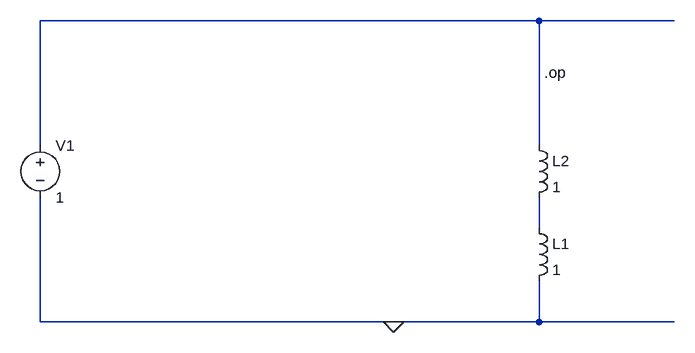
[diagram p0: schematic OP_V-DC_L+L.asc]
OP_V-DC_L+L.asc, the LTspice schematic file:
Version 4
SHEET 1 880 680
WIRE 640 64 -128 64
WIRE 848 64 640 64
WIRE -128 256 -128 64
WIRE 640 256 640 64
WIRE 640 384 640 336
WIRE -128 528 -128 336
WIRE 416 528 -128 528
WIRE 640 528 640 464
WIRE 640 528 416 528
WIRE 848 528 640 528
FLAG 416 528 0
SYMBOL voltage -128 240 R0
SYMATTR InstName V1
SYMATTR Value 1
SYMBOL ind 624 368 R0
SYMATTR InstName L1
SYMATTR Value 1
SYMBOL ind 624 240 R0
SYMATTR InstName L2
SYMATTR Value 1
TEXT 648 144 Left 2 !.op

The netlist it stands for:
* OP_V-DC_L+L.asc
V1 N001 0 1
L1 N002 0 1
L2 N001 N002 1
.op
.backanno
.end